# Altium schematic sheet Power Supply.SchDoc: Power Supply 5V @ 3A
size A; Engineer: H Potential; DocumentNumber: 5; Revision: 3.2; SheetNumber: 5; SheetTotal: 5
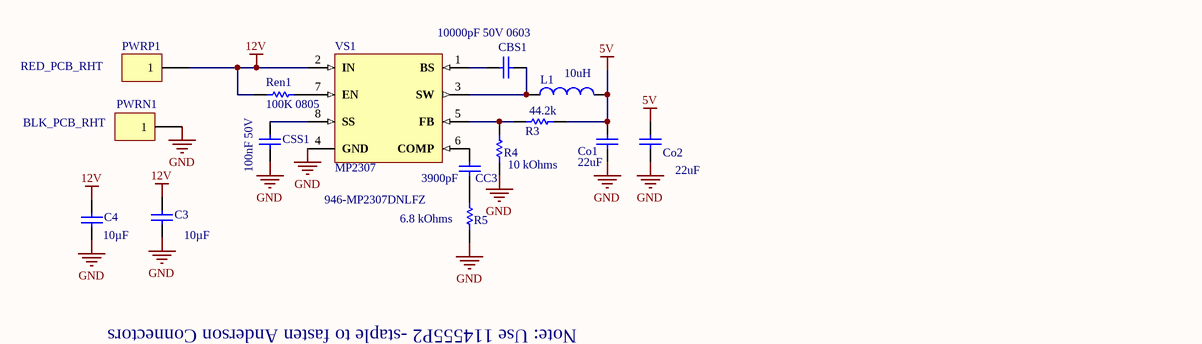
[diagram p0: Power Supply.SchDoc]

## Parts
C3  10µF  [CAPC2013X135X45ML10T25]
C4  10µF  [CAPC2013X135X45ML10T25]
CBS1  10000pF 50V 0603  [0603C_L]
CC3  3900pF  [0603C_L]
Co1  22uF  [0603C_L]
Co2  22uF  [0603C_L]
CSS1  100nF 50V  [0603C_L]
L1  10uH  [IND_1]
PWRN1  BLK_PCB_RHT  [Anderson_BLK_RHT_BOT]
PWRP1  RED_PCB_RHT  [Anderson_Red_RHT_BOT]
R3  44.2k  [0805_L]
R4  10 kOhms  [0805_L]
R5  6.8 kOhms  [0805_L]
Ren1  100K 0805  [0805_L]
VS1  MP2307  Supplier Part Number 1: 946-MP2307DNLFZ  [SOIC8N_EXP]

## Nets
5V: Co1.2 Co2.2 L1.2 R3.1
12V: C3.2 C4.2 PWRP1.1 Ren1.1 VS1.2(IN)
GND: C3.1 C4.1 Co1.1 Co2.1 CSS1.1 PWRN1.1 R4.2 R5.1 VS1.4(GND)
NetCBS1_1: CBS1.1 L1.1 VS1.3(SW)
NetCBS1_2: CBS1.2 VS1.1(BS)
NetCC3_1: CC3.1 R5.2
NetCC3_2: CC3.2 VS1.6(COMP)
NetCSS1_2: CSS1.2 VS1.8(SS)
NetR3_2: R3.2 R4.1 VS1.5(FB)
NetRen1_2: Ren1.2 VS1.7(EN)

## Notes on the sheet
- Note: Use 114555P2 -staple to fasten Anderson Connectors
- Title
- Size:
- Date:
- A
- Project:
- Time:
- Revision:
- Sheet
- of
- Engineer:
- File:

## Library data of the parts
C3 C4 = CMP-2007-03541-1: Part Number: GRM21BR61E106KA73L; Manufacturer: Murata; Product Training Modules: High-Cap Multilayer Ceramic Capacitors; Catalog Drawings: GRM Series_0805_1.25; Tolerance: ±10%; Voltage - Rated: 25V; Temperature Coefficient: X5R; Online Catalog: GRM Series; Other Names: 490-5523-6; Supplier 1: Digikey; Supplier Part Number 1: 490-5523-1-ND; Manufacturer Part Number: GRM21BR61E106KA73L; Stock 1: 750766; Pricing 1: 1=0.19, 10=0.13, 50=0.0748, 100=0.0618, 250=0.052, 500=0.0436, 1000=0.0358 (USD); Standard Package: 1; Category: Capacitors; Family: Ceramic Capacitors; Series: GRM; Packaging: Digi-Reel®; Capacitance: 10µF; Mounting Type: Surface Mount, MLCC; Operating Temperature: -55°C ~ 85°C; Applications: General Purpose; Ratings: -; Package / Case: 0805 (2012 Metric); Size / Dimension: 0.079" L x 0.049" W (2.00mm x 1.25mm); Height - Seated (Max): -; Thickness (Max): 0.053" (1.35mm); Lead Spacing: -; Features: -; Lead Style: -; ComponentLink1URL: https://datasheet.ciiva.com/139/partnumbering-e-01-139184.pdf; ComponentLink1Description: https://datasheet.ciiva.com/139/partnumbering-e-01-139184.pdf; ComponentLink2URL: https://datasheet.ciiva.com/28584/626718-28584288.pdf; ComponentLink2Description: https://datasheet.ciiva.com/28584/626718-28584288.pdf; ComponentLink3URL: https://datasheet.ciiva.com/16440/grm21br61e106ka73l-16440627.pdf; ComponentLink3Description: https://datasheet.ciiva.com/16440/grm21br61e106ka73l-16440627.pdf; ComponentLink4URL: https://datasheet.ciiva.com/7719/1747469-7719093.pdf; ComponentLink4Description: https://datasheet.ciiva.com/7719/1747469-7719093.pdf; ComponentLink5URL: https://datasheet.ciiva.com/5424/product-5424327.pdf; ComponentLink5Description: https://datasheet.ciiva.com/5424/product-5424327.pdf; ComponentLink6URL: https://datasheet.ciiva.com/28584/626718-28584279.pdf; ComponentLink6Description: https://datasheet.ciiva.com/28584/626718-28584279.pdf; ComponentLink7URL: https://datasheet.ciiva.com/14116/grmseries-highdielectrictype-eng-14116376.pdf; ComponentLink7Description: https://datasheet.ciiva.com/14116/grmseries-highdielectrictype-eng-14116376.pdf; ComponentLink8URL: https://datasheet.ciiva.com/22774/1747469-22774396.pdf; ComponentLink8Description: https://datasheet.ciiva.com/22774/1747469-22774396.pdf; ComponentLink9URL: https://datasheet.ciiva.com/139/partnumbering-e-01-139182.pdf; ComponentLink9Description: https://datasheet.ciiva.com/139/partnumbering-e-01-139182.pdf; ComponentLink10URL: https://datasheet.ciiva.com/139/partnumbering-e-01-139183.pdf; ComponentLink10Description: https://datasheet.ciiva.com/139/partnumbering-e-01-139183.pdf; ComponentLink11URL: https://datasheet.ciiva.com/29199/454623-da-01-en-vs-kondensator-0805-29199615.pdf; ComponentLink11Description: https://datasheet.ciiva.com/29199/454623-da-01-en-vs-kondensator-0805-29199615.pdf
CBS1 = Cap10000pF_50V_0603: Manufacturer: Yageo; Manufacturer Part Number: CC0603KRX7R9BB103; Product Training Modules: Multilayer Ceramic Capacitors; Featured Product: Commodity Multilayer Ceramic Capacitors – CC Series; Tolerance: ±10%; Temperature Coefficient: X7R; Online Catalog: CC Series; Other Names: 311-1085-6; Supplier 1: Digikey; Stock 1: 2765337; Pricing 1: 1=0.1, 10=0.018, 25=0.0132, 50=0.0098, 100=0.008, 250=0.0067, 500=0.0057, 1000=0.0045 (USD); Standard Package: 1; Category: Capacitors; Family: Ceramic Capacitors; Series: CC; Packaging: Digi-Reel®; Capacitance: 10000pF; Voltage - Rated: 50V; Mounting Type: Surface Mount, MLCC; Operating Temperature: -55°C ~ 125°C; Applications: General Purpose; Ratings: -; Package / Case: 0603 (1608 Metric); Size / Dimension: 0.063" L x 0.031" W (1.60mm x 0.80mm); Height - Seated (Max): -; Thickness (Max): 0.035" (0.90mm); Lead Spacing: -; Features: -; Lead Style: -; ComponentLink1URL: https://datasheet.ciiva.com/8033/1734573-8033861.pdf; ComponentLink1Description: https://datasheet.ciiva.com/8033/1734573-8033861.pdf; ComponentLink2URL: https://datasheet.ciiva.com/176/mlccorderingcode-176550.pdf; ComponentLink2Description: https://datasheet.ciiva.com/176/mlccorderingcode-176550.pdf; ComponentLink3URL: https://datasheet.ciiva.com/11788/0900766b8079c870-11788374.pdf; ComponentLink3Description: https://datasheet.ciiva.com/11788/0900766b8079c870-11788374.pdf; ComponentLink4URL: https://datasheet.ciiva.com/176/mlccorderingcode-176551.pdf; ComponentLink4Description: https://datasheet.ciiva.com/176/mlccorderingcode-176551.pdf; ComponentLink5URL: https://datasheet.ciiva.com/13389/upy-gphc-x7r-6-3v-to-50v-8-13389991.pdf; ComponentLink5Description: https://datasheet.ciiva.com/13389/upy-gphc-x7r-6-3v-to-50v-8-13389991.pdf; ComponentLink6URL: https://datasheet.ciiva.com/176/mlccorderingcode-176552.pdf; ComponentLink6Description: https://datasheet.ciiva.com/176/mlccorderingcode-176552.pdf; ComponentLink7URL: https://datasheet.ciiva.com/8033/1734573-8033816.pdf; ComponentLink7Description: https://datasheet.ciiva.com/8033/1734573-8033816.pdf; ComponentLink8URL: https://datasheet.ciiva.com/8033/70765-8033817.pdf; ComponentLink8Description: https://datasheet.ciiva.com/8033/70765-8033817.pdf; ComponentLink9URL: https://datasheet.ciiva.com/16625/upy-gphc-x7r-6-3v-to-50v-8-16625529.pdf; ComponentLink9Description: https://datasheet.ciiva.com/16625/upy-gphc-x7r-6-3v-to-50v-8-16625529.pdf; ComponentLink10URL: https://datasheet.ciiva.com/28450/1489800-28450619.pdf; ComponentLink10Description: https://datasheet.ciiva.com/28450/1489800-28450619.pdf; ComponentLink11URL: https://datasheet.ciiva.com/26862/getdatasheetpartid-403582-26862846.pdf; ComponentLink11Description: https://datasheet.ciiva.com/26862/getdatasheetpartid-403582-26862846.pdf; Supplier Part Number 1: 311-1085-1-ND
CC3 = Cap_0603_1: Manufacturer: Murata; Manufacturer Part Number: GRM188R71E392KA01D; Tolerance (+ or -): 10%; Voltage: 25VDC; Temp Coeff (Dielectric): X7R; Case Style: Ceramic Chip; Wire Form: Not Required; Product Length (mm): 1.6mm; Product Depth (mm): 0.8mm; Product Diameter (mm): Not Requiredmm; Supplier 1: Digikey; Supplier Part Number 1: 490-11525-1-ND; Stock 1: 12327; Pricing 1: 1=0.1, 10=0.072, 50=0.039, 100=0.033, 250=0.027, 500=0.0231, 1000=0.018 (USD); Capacitance: 3900pF; Operating Temp Range: -55C to 125C; Mounting Style: Surface Mount; Package / Case: 0603; Construction: SMT Chip; Failure Rate: Not Required; Product Height (mm): 0.8mm; Packaging: Tape and Reel; ComponentLink1URL: https://datasheet.ciiva.com/5420/product-5420128.pdf; ComponentLink1Description: https://datasheet.ciiva.com/5420/product-5420128.pdf; ComponentLink2URL: https://datasheet.ciiva.com/164/partnumbering-e-01-164755.pdf; ComponentLink2Description: https://datasheet.ciiva.com/164/partnumbering-e-01-164755.pdf
Co1 Co2 = Cap_0603_1: Manufacturer: Murata; Manufacturer Part Number: GRM188R60J226MEA0D; Tolerance (+ or -): 20%; Voltage: 6.3VDC; Temp Coeff (Dielectric): X5R; Case Style: Ceramic Chip; Wire Form: Not Required; Product Length (mm): 1.6mm; Product Depth (mm): 0.8mm; Product Diameter (mm): Not Requiredmm; Supplier 1: Digikey; Supplier Part Number 1: 490-7611-1-ND; Stock 1: 2044559; Pricing 1: 1=0.27, 10=0.182, 50=0.11, 100=0.0924, 250=0.0748, 500=0.066, 1000=0.0561 (USD); Capacitance: 22uF; Operating Temp Range: -55C to 125C; Mounting Style: Surface Mount; Package / Case: 0603; Construction: SMT Chip; Failure Rate: Not Required; Product Height (mm): 0.8mm; Packaging: Tape and Reel; ComponentLink1URL: https://datasheet.ciiva.com/29540/partnumbering-e-01-29540441.pdf; ComponentLink1Description: https://datasheet.ciiva.com/29540/partnumbering-e-01-29540441.pdf; ComponentLink2URL: https://datasheet.ciiva.com/29540/partnumbering-e-01-29540442.pdf; ComponentLink2Description: https://datasheet.ciiva.com/29540/partnumbering-e-01-29540442.pdf; ComponentLink3URL: https://datasheet.ciiva.com/29540/partnumbering-e-01-29540443.pdf; ComponentLink3Description: https://datasheet.ciiva.com/29540/partnumbering-e-01-29540443.pdf
CSS1 = Cap100nF_50V_0603: Manufacturer: Yageo; Manufacturer Part Number: CC0603ZRY5V9BB104; Capacitance: 0.10µF; Tolerance: -20%, +80%; Temperature Coefficient: Y5V (F); Supplier 1: Digi-Key; Supplier Part Number 1: 311-1343-1-ND; RoHS: RoHS Compliant; Category: Capacitors; Stock 1: 1827128; Pricing 1: 1=0.1, 10=0.018, 25=0.0128, 100=0.0082, 250=0.00672, 500=0.00574, 1000=0.00447 (USD); Packaging: Cut Tape (CT); Part Status: Active; Voltage - Rated: 50V; Operating Temperature: -30°C ~ 85°C; Features: -; Ratings: -; Applications: General Purpose; Failure Rate: -; Mounting Type: Surface Mount, MLCC; Package / Case: 0603 (1608 Metric); Size / Dimension: 0.063" L x 0.031" W (1.60mm x 0.80mm); Height - Seated (Max): -; Thickness (Max): 0.035" (0.90mm); Lead Spacing: -; Lead Style: -; ComponentLink1URL: http://www.yageo.com/documents/recent/UPY-GPHC_Y5V_6.3V-to-50V_6.pdf; ComponentLink1Description: http://www.yageo.com/documents/recent/UPY-GPHC_Y5V_6.3V-to-50V_6.pdf
L1 = Inductor: Manufacturer: Abracon; Manufacturer Part Number: ASPI-0630LR-100M-T15; Code_IEC: 1005; Rad Hard: No; Type: Power; Maximum DC Current: 4 A; Tolerance: 20 %; Maximum DC Resistance: 68 mOhm; Product Depth: 6.65 mm; Product Height: 3(Max) mm; Published: 8-Jun-2000; LatestRevisionDate: 29-May-2009; LatestRevisionNote: IPC-7351 Footprint Added.; Publisher: Altium Limited; PackageDescription: Chip Inductor; Code_JEITA: 0402; Value: 10uH; Supplier 1: Digikey; Stock 1: 9671; Pricing 1: 1=0.81, 10=0.706, 25=0.6552, 50=0.5544, 100=0.504, 250=0.4738, 500=0.4234 (USD); Package/Case: 2826; Packaging: Tape & Reel; Inductance: 10 uH; Category: Inductor Surface Mount; ComponentLink1URL: https://datasheet.ciiva.com/29994/aspi-0630lr-29994299.pdf; ComponentLink1Description: https://datasheet.ciiva.com/29994/aspi-0630lr-29994299.pdf; Supplier Part Number 1: ASPI-0630LR-100M-T15CT-ND
PWRN1 = Anderson-1Pin BLK_PCB_RHT: 1 pin Anderson; Manufacturer: Anderson Power Products (APP); Manufacturer Part Number: 1377G1, 1377G2, 1327-BK,137G6-BK; Number of Positions / Contacts: 1; Voltage Rating: 600 V; Current Rating: 25 A; Mouser: 879-1327G6; Mouser: 879-1327; Mouser: 879-1377G2; Mouser: 879-1377G1; Supplier 1: Mouser; Stock 1: 233; Pricing 1: 1=1.14, 10=1.14, 50=0.947, 100=0.901, 1000=0.777, 10000=0.777 (USD); Termination Style: Solder; Series: PCB Powerpole; Product Type: Contacts; Contact Material: Copper Alloy; Contact Plating: Tin; ComponentLink1URL: http://components.arrow.com/part/dataview/0323_01933244; ComponentLink1Description: http://components.arrow.com/part/dataview/0323_01933244; ComponentLink2URL: http://www.andersonpower.com/files.php?file=CAT-PPMP(4).pdf; ComponentLink2Description: http://www.andersonpower.com/files.php?file=CAT-PPMP(4).pdf; Supplier Part Number 2: 879-1377G2; Supplier Part Number 1: 879-1377G1; Supplier Part Number 3: 879-1327G6; Supplier Part Number 4: 879-1327
PWRP1 = Anderson-1Pin RED_PCB_RHT: 1 pin Anderson; Manufacturer: Anderson Power Products (APP); Manufacturer Part Number: 1377G1, 1377G2, 1327-BK,137G6-BK; Number of Positions / Contacts: 1; Voltage Rating: 600 V; Current Rating: 25 A; Mouser: 879-1327G6; Mouser: 879-1327; Mouser: 879-1377G2; Mouser: 879-1377G1; Supplier 1: Mouser; Stock 1: 233; Pricing 1: 1=1.14, 10=1.14, 50=0.947, 100=0.901, 1000=0.777, 10000=0.777 (USD); Termination Style: Solder; Series: PCB Powerpole; Product Type: Contacts; Contact Material: Copper Alloy; Contact Plating: Tin; ComponentLink1URL: http://components.arrow.com/part/dataview/0323_01933244; ComponentLink1Description: http://components.arrow.com/part/dataview/0323_01933244; ComponentLink2URL: http://www.andersonpower.com/files.php?file=CAT-PPMP(4).pdf; ComponentLink2Description: http://www.andersonpower.com/files.php?file=CAT-PPMP(4).pdf; Supplier Part Number 2: 879-1377G2; Supplier Part Number 1: 879-1377G1; Supplier Part Number 3: 879-1327G6; Supplier Part Number 4: 879-1327
R3 = Res_0805: Manufacturer: Yageo; Manufacturer Part Number: RC0805FR-0744K2L; Product Training Modules: Chip Resistor; Catalog Drawings: Thick Film Resistor Side; PCN Other: RC/AC 0603/0805/1206 22/Jan/2013; HTML Datasheet: RC Series, L Suffix Datasheet.html; EDA / CAD Models: Download from Accelerated Designs; Tolerance: ±1%; Power (Watts): 0.125W, 1/8W; Temperature Coefficient: ±100ppm/°C; Online Catalog: RC0805 Series; Kits: PHC5A-KIT-ND  - RESISTOR KIT 10K-97.6K 1/8W PHC5-KIT-ND  - RESISTOR KIT 10K-97.6K 1/8W; Other Names: 311-44.2KCRCT; Supplier 1: Digikey; Supplier Part Number 1: 311-44.2KCRCT-ND; Stock 1: 52103; Pricing 1: 1=0.1, 10=0.019, 25=0.0136, 50=0.0104, 100=0.0077, 250=0.0058, 500=0.0047, 1000=0.0035 (USD); Standard Package: 1; Category: Resistors; Family: Chip Resistor - Surface Mount; Series: RC; Packaging: Cut Tape (CT); Resistance (Ohms): 44.2k; Composition: Thick Film; Features: Moisture Resistant; Operating Temperature: -55°C ~ 155°C; Package / Case: 0805 (2012 Metric); Supplier Device Package: 0805; Size / Dimension: 0.079" L x 0.049" W (2.00mm x 1.25mm); Height: 0.024" (0.60mm); Number of Terminations: 2; ComponentLink1URL: https://datasheet.ciiva.com/2519/pyu-r-int-thick-7-2519792.pdf; ComponentLink1Description: https://datasheet.ciiva.com/2519/pyu-r-int-thick-7-2519792.pdf; ComponentLink2URL: https://datasheet.ciiva.com/2519/pyu-r-int-thick-7-2519793.pdf; ComponentLink2Description: https://datasheet.ciiva.com/2519/pyu-r-int-thick-7-2519793.pdf; ComponentLink3URL: https://datasheet.ciiva.com/2519/pyu-r-int-thick-7-2519794.pdf; ComponentLink3Description: https://datasheet.ciiva.com/2519/pyu-r-int-thick-7-2519794.pdf; ComponentLink4URL: https://datasheet.ciiva.com/17074/rc0805-17074805.pdf; ComponentLink4Description: https://datasheet.ciiva.com/17074/rc0805-17074805.pdf
R4 = Res_0805: Manufacturer: Yageo; Manufacturer Part Number: RC0805FR-0710KL; Tolerance: 1 %; Power Rating: 125 mW (1/8 W); Voltage Rating: 150 V; Temperature Coefficient: 100 PPM / C; Supplier 1: Digikey; Supplier Part Number 1: 311-10.0KCRCT-ND; Stock 1: 8894385; Pricing 1: 1=0.1, 10=0.019, 25=0.0136, 50=0.0104, 100=0.0077, 250=0.0058, 500=0.0047, 1000=0.0035 (USD); Termination Style: SMD/SMT; Product: Thick Film Resistors General Purpose; Resistance: 10 kOhms; Case Code - in: 0805; Case Code - mm: 2012; Series: RC; Operating Temperature Range: - 55 C to + 155 C; Packaging: Reel; ComponentLink1URL: https://datasheet.ciiva.com/11808/0900766b8106beab-11808151.pdf; ComponentLink1Description: https://datasheet.ciiva.com/11808/0900766b8106beab-11808151.pdf; ComponentLink2URL: https://datasheet.ciiva.com/12669/rc0805-12669688.pdf; ComponentLink2Description: https://datasheet.ciiva.com/12669/rc0805-12669688.pdf; ComponentLink3URL: https://datasheet.ciiva.com/46447/444164-46447563.pdf; ComponentLink3Description: https://datasheet.ciiva.com/46447/444164-46447563.pdf; ComponentLink4URL: https://datasheet.ciiva.com/2456/pyu-r-int-thick-7-2456972.pdf; ComponentLink4Description: https://datasheet.ciiva.com/2456/pyu-r-int-thick-7-2456972.pdf; ComponentLink5URL: https://datasheet.ciiva.com/2456/pyu-r-int-thick-7-2456973.pdf; ComponentLink5Description: https://datasheet.ciiva.com/2456/pyu-r-int-thick-7-2456973.pdf; ComponentLink6URL: https://datasheet.ciiva.com/2456/pyu-r-int-thick-7-2456974.pdf; ComponentLink6Description: https://datasheet.ciiva.com/2456/pyu-r-int-thick-7-2456974.pdf; ComponentLink7URL: https://datasheet.ciiva.com/16747/rc0805-16747087.pdf; ComponentLink7Description: https://datasheet.ciiva.com/16747/rc0805-16747087.pdf
R5 = Res_0805: Manufacturer: Yageo; Manufacturer Part Number: RC0805JR-076K8L; Tolerance: 5 %; Power Rating: 125 mW (1/8 W); Voltage Rating: 150 V; Temperature Coefficient: 100 PPM / C; Supplier 1: Digikey; Supplier Part Number 1: 311-6.8KARCT-ND; Stock 1: 71971; Pricing 1: 1=0.1, 10=0.016, 25=0.0116, 50=0.009, 100=0.0066, 250=0.005, 500=0.004, 1000=0.003 (USD); Termination Style: SMD/SMT; Product: Thick Film Resistors General Purpose; Resistance: 6.8 kOhms; Case Code - in: 0805; Case Code - mm: 2012; Series: RC; Operating Temperature Range: - 55 C to + 155 C; Packaging: Reel; ComponentLink1URL: https://datasheet.ciiva.com/2456/pyu-r-int-thick-7-2456128.pdf; ComponentLink1Description: https://datasheet.ciiva.com/2456/pyu-r-int-thick-7-2456128.pdf; ComponentLink2URL: https://datasheet.ciiva.com/2456/pyu-r-int-thick-7-2456129.pdf; ComponentLink2Description: https://datasheet.ciiva.com/2456/pyu-r-int-thick-7-2456129.pdf; ComponentLink3URL: https://datasheet.ciiva.com/2456/pyu-r-int-thick-7-2456130.pdf; ComponentLink3Description: https://datasheet.ciiva.com/2456/pyu-r-int-thick-7-2456130.pdf; ComponentLink4URL: https://datasheet.ciiva.com/17196/rc0805-17196091.pdf; ComponentLink4Description: https://datasheet.ciiva.com/17196/rc0805-17196091.pdf; ComponentLink5URL: https://datasheet.ciiva.com/7941/442941-7941997.pdf; ComponentLink5Description: https://datasheet.ciiva.com/7941/442941-7941997.pdf; ComponentLink6URL: https://datasheet.ciiva.com/7941/442941-7941998.pdf; ComponentLink6Description: https://datasheet.ciiva.com/7941/442941-7941998.pdf; ComponentLink7URL: https://datasheet.ciiva.com/12666/rc0805-12666991.pdf; ComponentLink7Description: https://datasheet.ciiva.com/12666/rc0805-12666991.pdf
Ren1 = Res100K_080: Manufacturer: Panasonic / Panasonic ECG; Manufacturer Part Number: ERJ-6GEYJ104V; Rated Power: 0.125 W; Resistance: 100 kO; Tolerance (%): ±5 %; Temp Coefficient: ±200 ppm/°C; Supplier 1: Digikey; Stock 1: 748133; Pricing 1: 1=0.1, 50=0.015, 100=0.011, 250=0.0084, 500=0.0067, 1000=0.005 (USD); ComponentLink1URL: https://datasheet.ciiva.com/11821/0900766b80f806dd-11821506.pdf; ComponentLink1Description: https://datasheet.ciiva.com/11821/0900766b80f806dd-11821506.pdf; Supplier Part Number 1: P100KACT-ND; Size Code: 0805; ComponentLink2URL: https://datasheet.ciiva.com/16771/70255313-16771462.pdf; ComponentLink2Description: https://datasheet.ciiva.com/16771/70255313-16771462.pdf; ComponentLink3URL: https://datasheet.ciiva.com/43460/1500035-43460136.pdf; ComponentLink3Description: https://datasheet.ciiva.com/43460/1500035-43460136.pdf; ComponentLink4URL: https://datasheet.ciiva.com/22758/1500035-22758234.pdf; ComponentLink4Description: https://datasheet.ciiva.com/22758/1500035-22758234.pdf; ComponentLink5URL: https://datasheet.ciiva.com/17208/aoa0000ce1-17208156.pdf; ComponentLink5Description: https://datasheet.ciiva.com/17208/aoa0000ce1-17208156.pdf; ComponentLink6URL: https://datasheet.ciiva.com/30137/4aoa0000ce1-30137389.pdf; ComponentLink6Description: https://datasheet.ciiva.com/30137/4aoa0000ce1-30137389.pdf; ComponentLink7URL: https://datasheet.ciiva.com/9117/aoa0000ce1-9117374.pdf; ComponentLink7Description: https://datasheet.ciiva.com/9117/aoa0000ce1-9117374.pdf; ComponentLink8URL: https://datasheet.ciiva.com/34303/2007290-34303759.pdf; ComponentLink8Description: https://datasheet.ciiva.com/34303/2007290-34303759.pdf; ComponentLink9URL: https://datasheet.ciiva.com/46380/1500035-46380511.pdf; ComponentLink9Description: https://datasheet.ciiva.com/46380/1500035-46380511.pdf
VS1 = MP2307: Manufacturer: Monolithic Power Systems (MPS); Manufacturer Part Number: MP2307DN-LF-Z; Input Voltage MAX: 23 V; Switching Frequency: 340 kHz; Output Voltage: 0.925 V to 20 V; Output Current: 3 A; Number of Outputs: 1 Output; Input Voltage MIN: 4.75 V; Supply Current: 1.3 mA; Topology: Buck; Supplier 1: Mouser; Stock 1: 1758; Pricing 1: 1=4, 10=3.31, 50=3.31, 100=2.93, 1000=1.99, 10000=1.89 (USD); Product Category: Voltage Regulators - Switching Regulators; RoHS: Details; Maximum Operating Temperature: + 85 C; Mounting Style: SMD/SMT; Package / Case: SOIC-8 EP; Brand: Monolithic Power Systems (MPS); Minimum Operating Temperature: - 40 C; Packaging: Reel; Series: MP2307DN; Factory Pack Quantity: 2500; Type: Step-Down DC/DC Converter; ComponentLink1URL: https://datasheet.ciiva.com/12215/mp2307-r1-9-371737-12215450.pdf; ComponentLink1Description: https://datasheet.ciiva.com/12215/mp2307-r1-9-371737-12215450.pdf